# Altium schematic sheet Sheet1.SchDoc
size A1; SheetNumber: 1; SheetTotal: 1
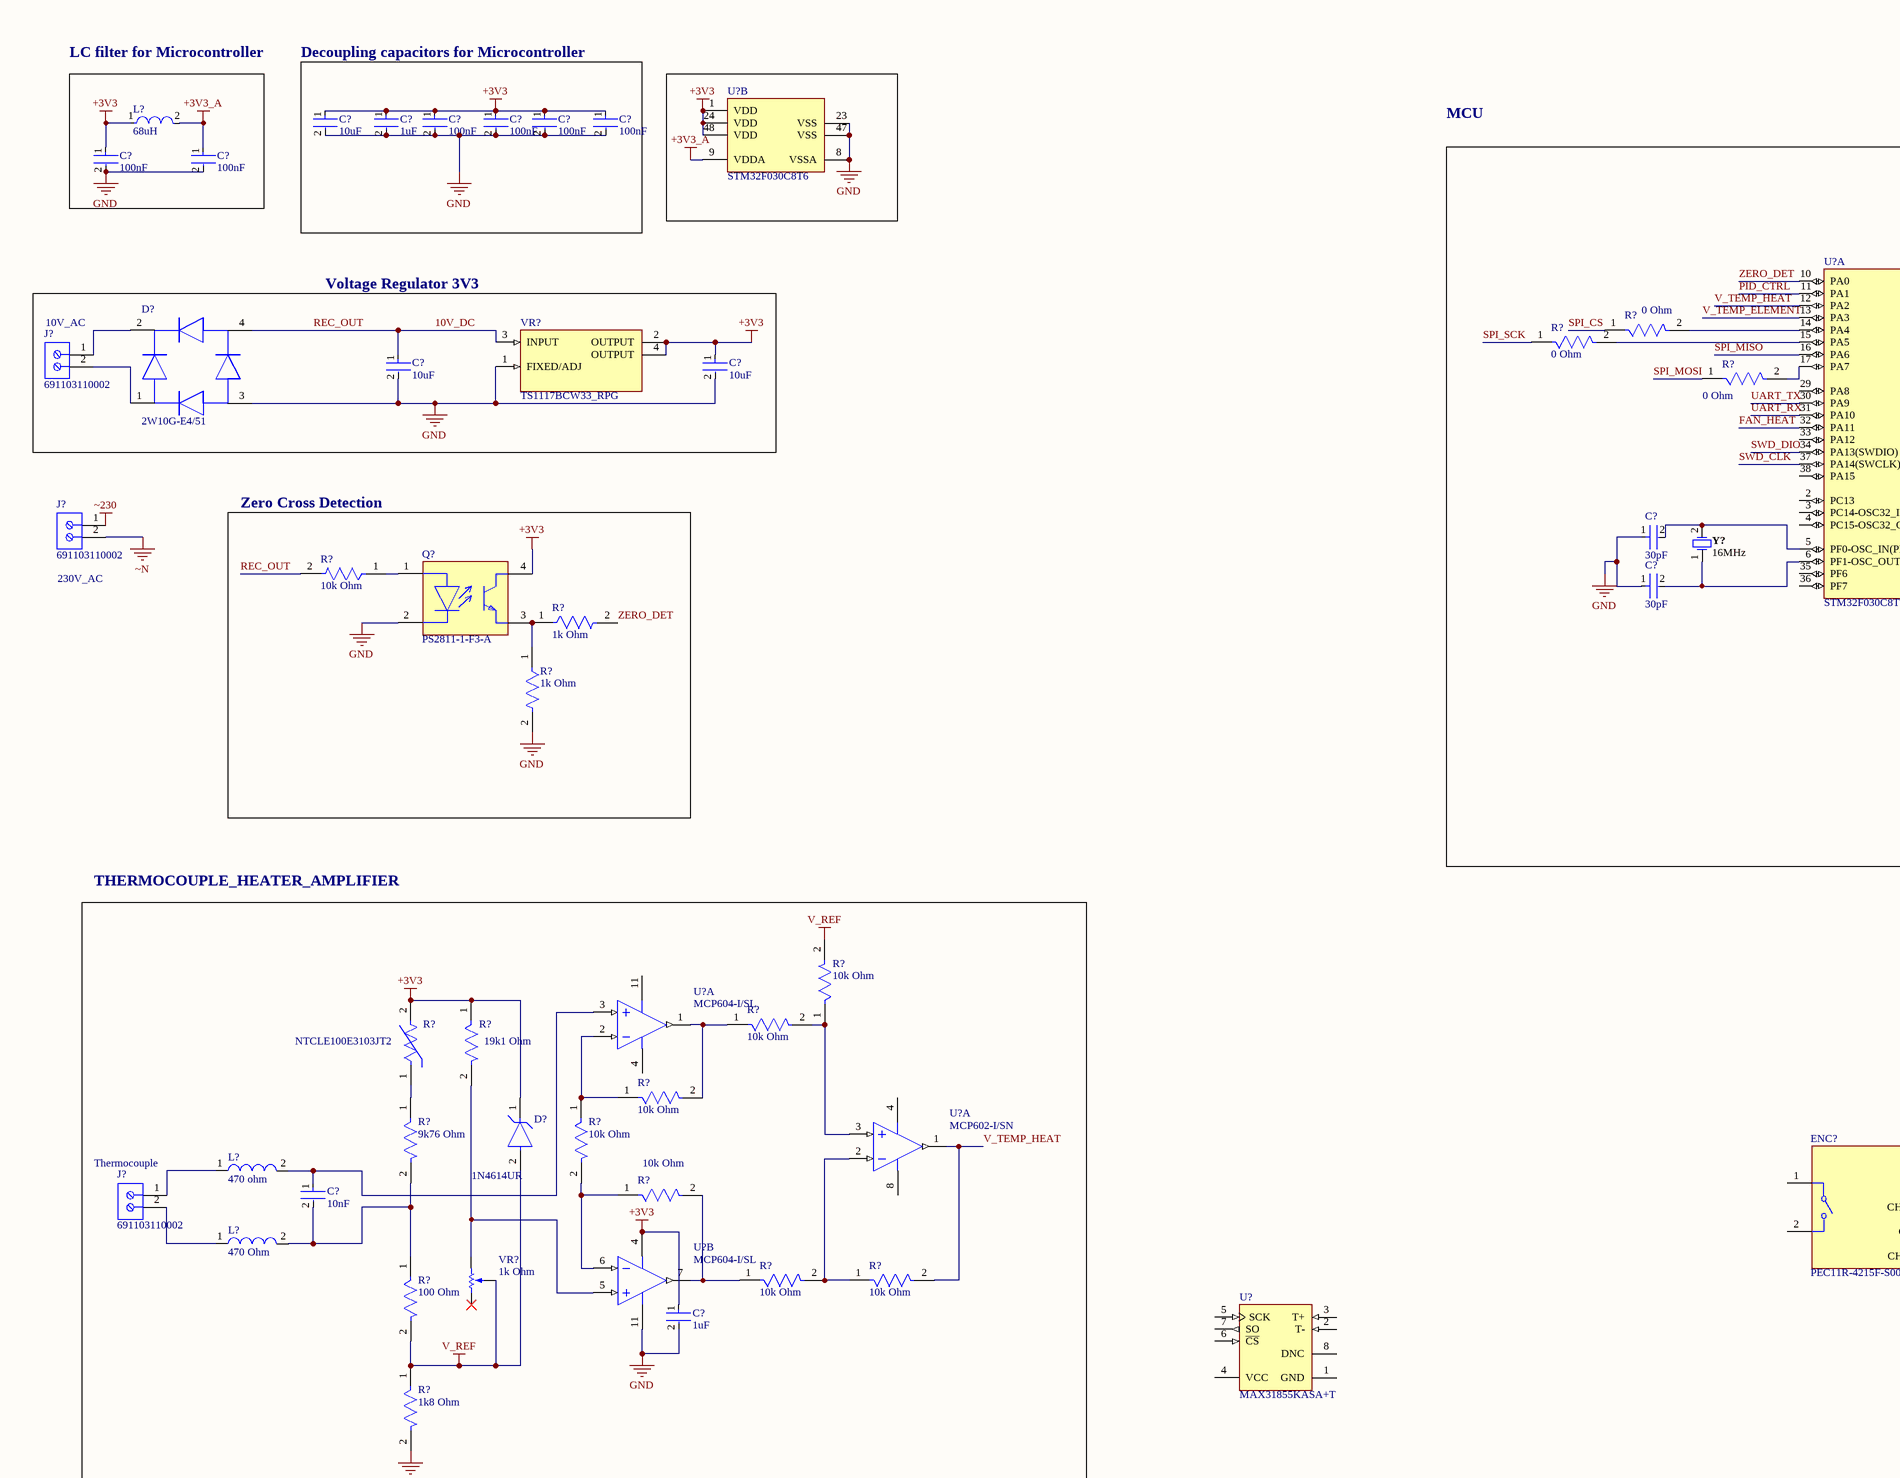
[diagram p0: Sheet1.SchDoc, top left]
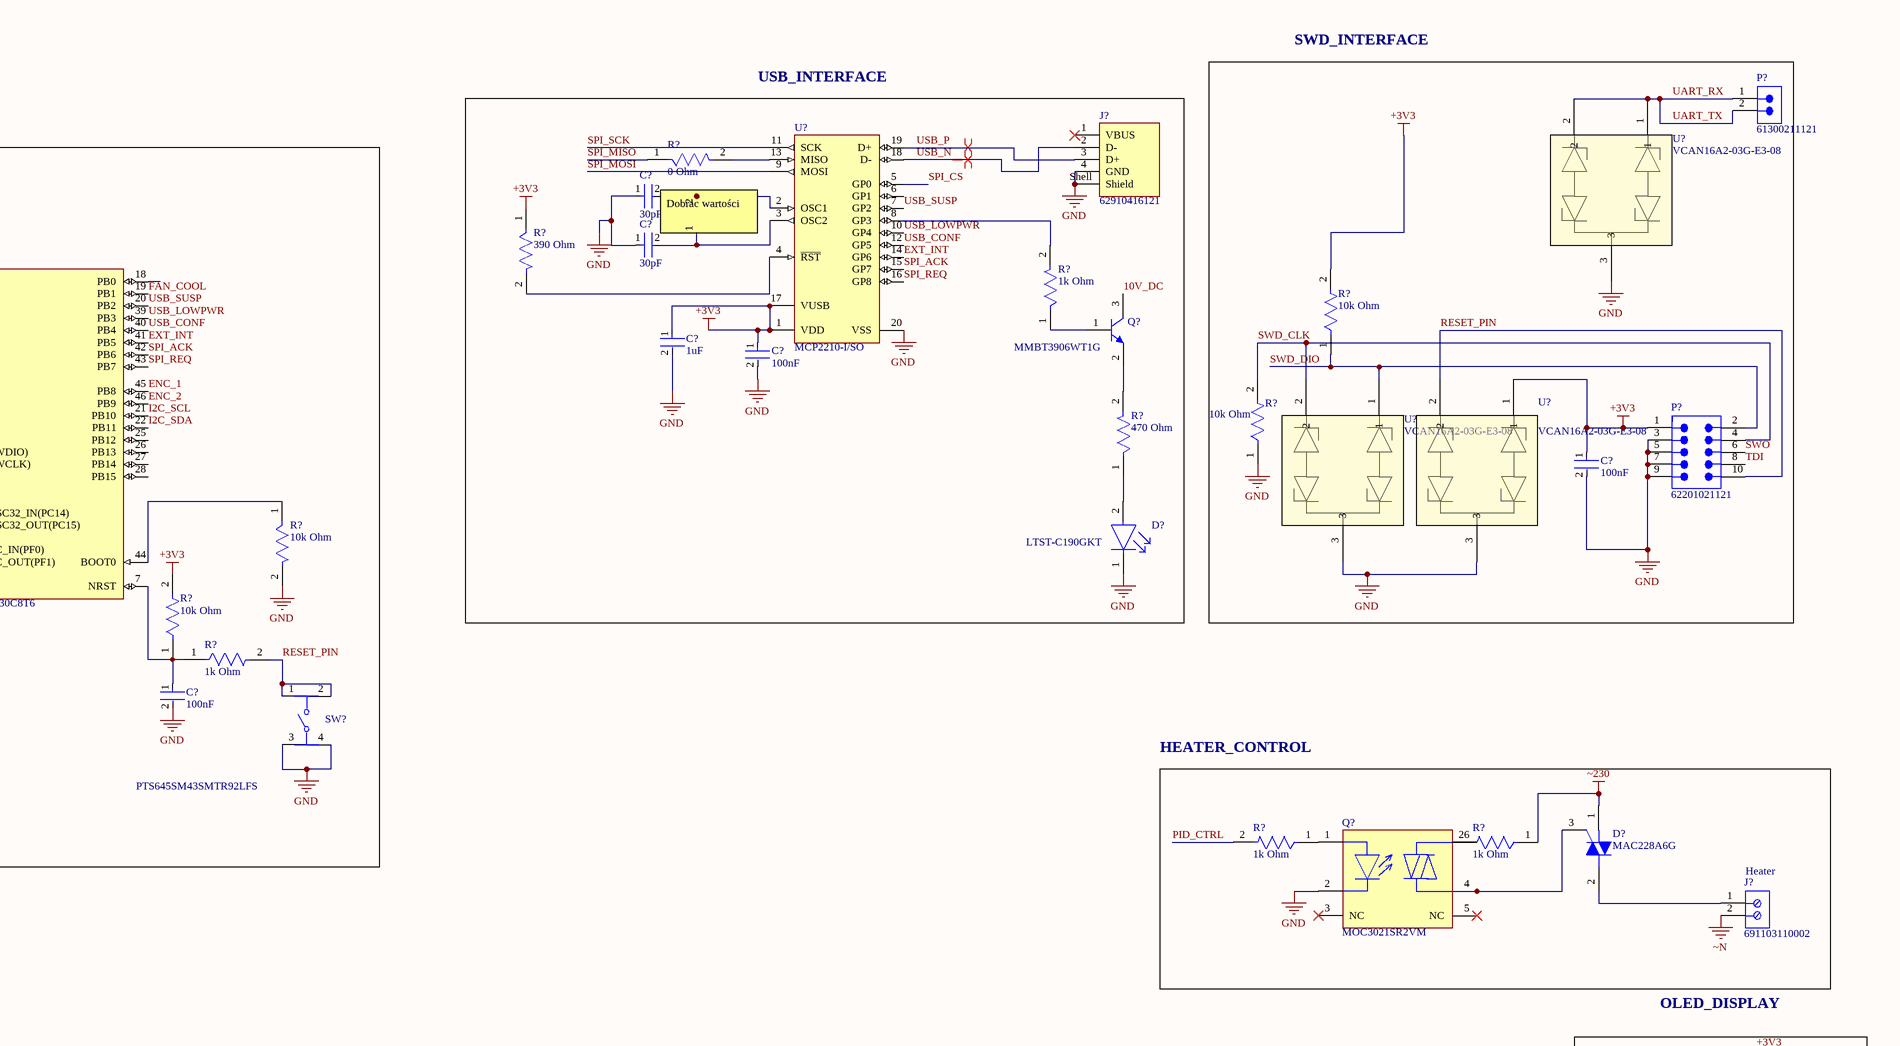
[diagram p1: Sheet1.SchDoc, top right]
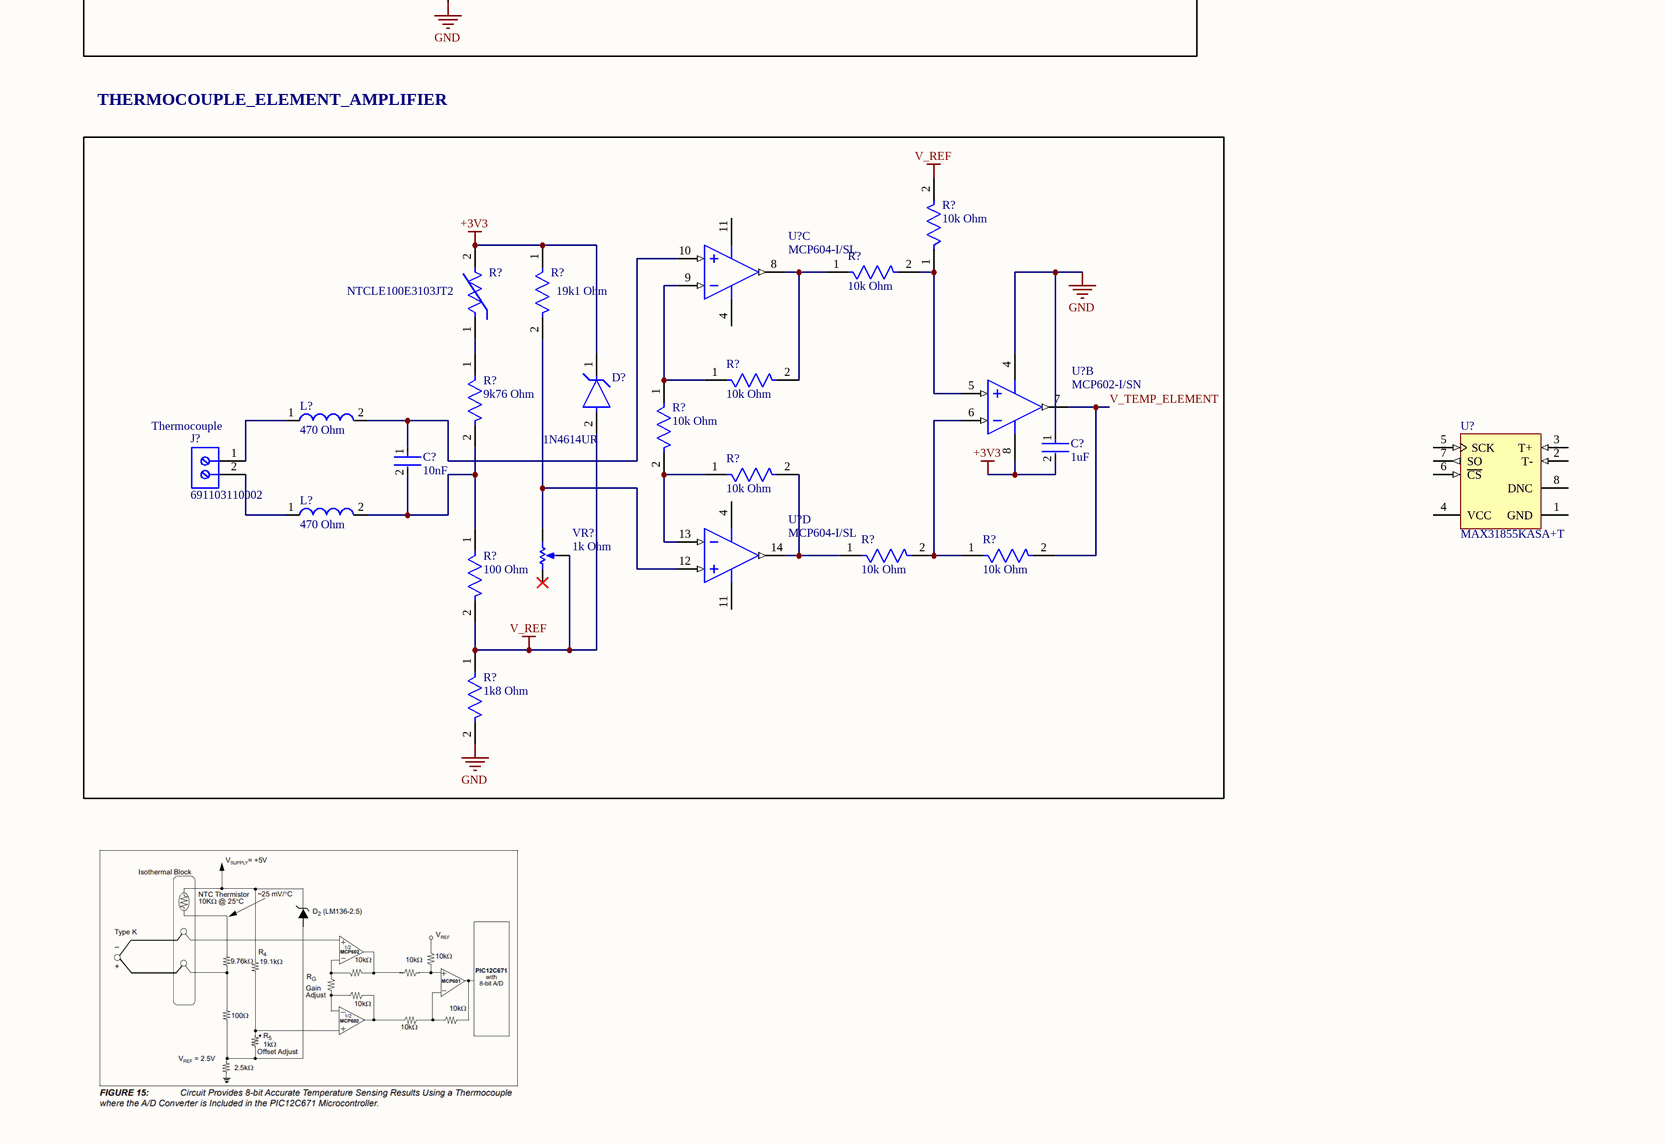
[diagram p2: Sheet1.SchDoc, bottom left]
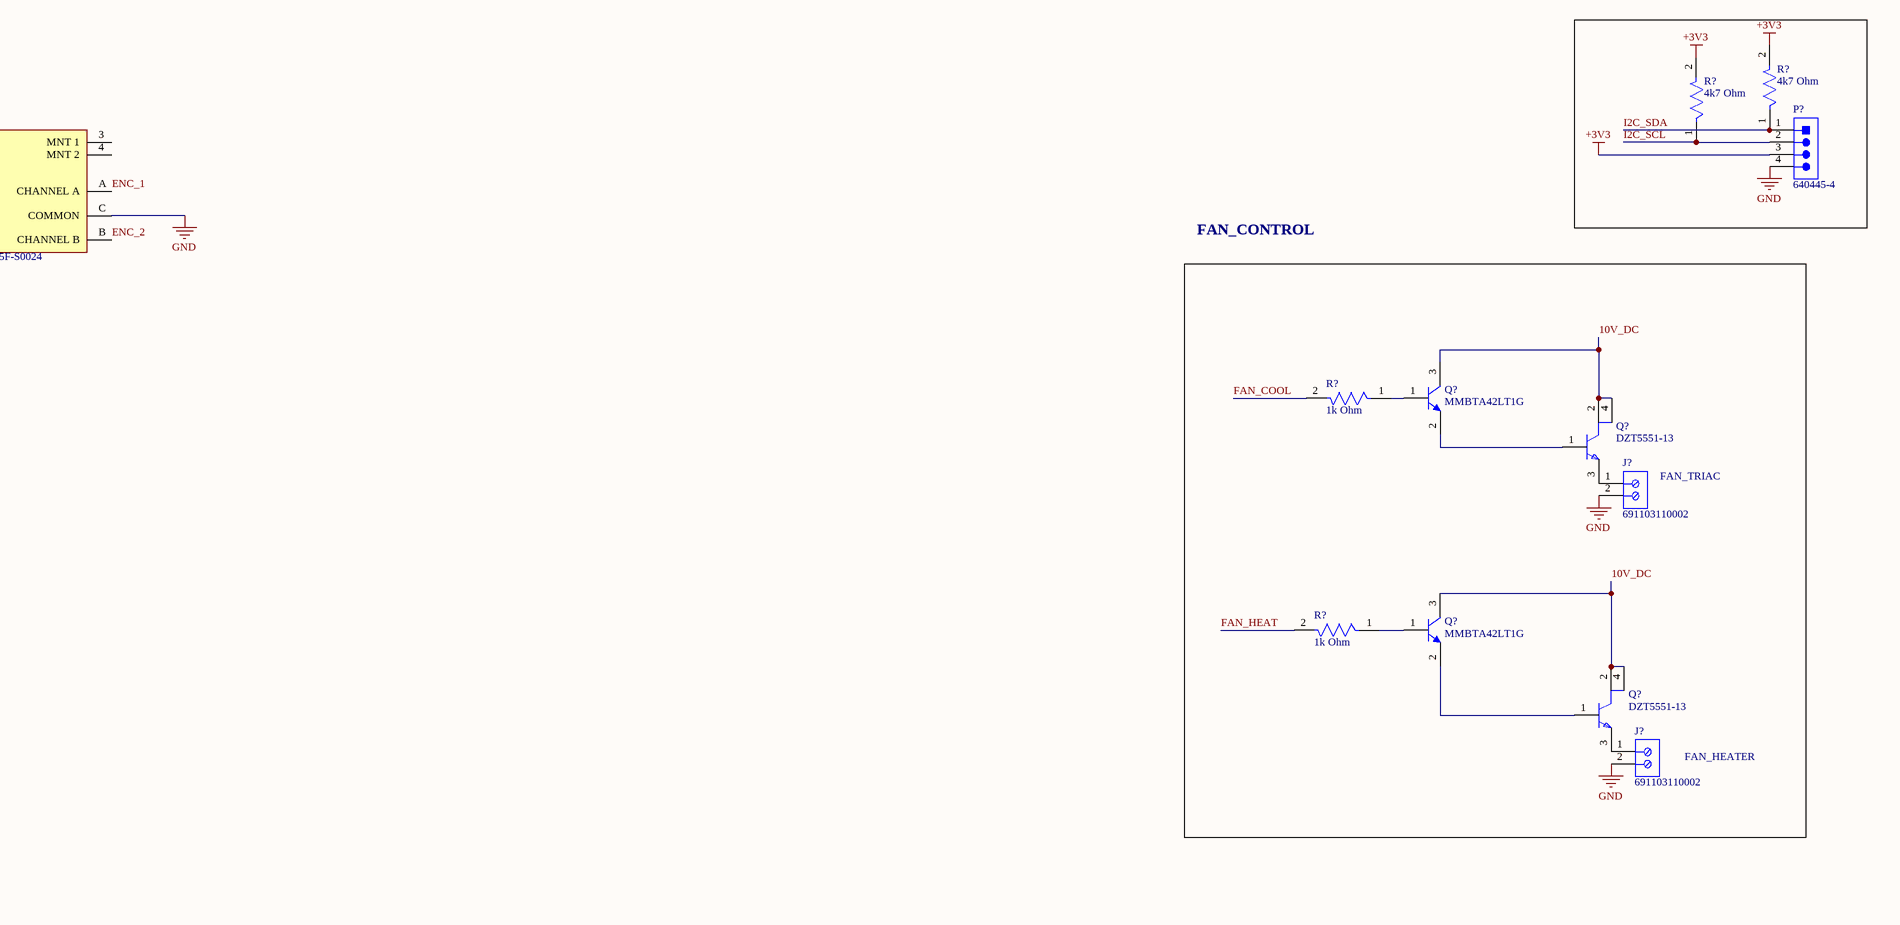
[diagram p3: Sheet1.SchDoc, bottom right]

## Parts
(Parts that share a designator on the sheet are numbered #1, #2 ... from top to bottom, then left to right.)
C?#1  10uF  [FP-CC0805-0_85-MFG]
C?#2  1uF  [FP-CC0805-0_85-MFG]
C?#3  100nF  [FP-CC0805-0_85-MFG]
C?#4  100nF  [FP-CC0805-0_85-MFG]
C?#5  100nF  [FP-CC0805-0_85-MFG]
C?#6  100nF  [FP-CC0805-0_85-MFG]
C?#7  100nF  [FP-CC0805-0_85-MFG]
C?#8  100nF  [FP-CC0805-0_85-MFG]
C?#9  30pF  [FP-CC0805-0_85-MFG]
C?#10  30pF  [FP-CC0805-0_85-MFG]
C?#11  1uF  [FP-CC0805-0_85-MFG]
C?#12  100nF  [FP-CC0805-0_85-MFG]
C?#13  10uF  [FP-CC0805-0_85-MFG]
C?#14  10uF  [FP-CC0805-0_85-MFG]
C?#15  100nF  [FP-CC0805-0_85-MFG]
C?#16  30pF  [FP-CC0805-0_85-MFG]
C?#17  30pF  [FP-CC0805-0_85-MFG]
C?#18  100nF  [FP-CC0805-0_85-MFG]
C?#19  10nF  [FP-CC0805-0_85-MFG]
C?#20  1uF  [FP-CC0805-0_85-MFG]
C?#21  1uF  [FP-CC0805-0_85-MFG]
C?#22  10nF  [FP-CC0805-0_85-MFG]
D?#1  2W10G-E4/51  [FP-WOG-MFG]
D?#2  LTST-C190GKT  [FP-LTST-C190GKT-MFG]
D?#3  MAC228A6G  [ONSC-TO-220-3-221A-09]
D?#4  1N4614UR  [FP-DO-213AA-MFG]
D?#5  1N4614UR  [FP-DO-213AA-MFG]
ENC?  PEC11R-4215F-S0024  [FP-PEC11R-4215F-S0024-MFG]
J?#1  62910416121  [62910416121]
J?#2  691103110002  [691103110002]
J?#3  691103110002  [691103110002]
J?#4  691103110002  [691103110002]
J?#5  691103110002  [691103110002]
J?#6  691103110002  [691103110002]
J?#7  691103110002  [691103110002]
J?#8  691103110002  [691103110002]
L?#1  68uH  [FP-CB2518-MFG]
L?#2  470 ohm  [SMD-0805]
L?#3  470 Ohm  [SMD-0805]
L?#4  470 Ohm  [SMD-0805]
L?#5  470 Ohm  [SMD-0805]
P?#1  61300211121  [61300211121]
P?#2  62201021121  [62201021121]
P?#3  640445-4  [TECO-640445-4_V]
Q?#1  MMBT3906WT1G  [ONSC-SC-70-3-419-04_V]
Q?#2  PS2811-1-F3-A  [SOP127P700X210_HS-5_SO4-Opto2_N]
Q?#3  MOC3021SR2VM  [FP-646BY-MFG]
Q?#4  MMBTA42LT1G  [ONSC-SOT-23-3-318-08_V]
Q?#5  DZT5551-13  [FP-SOT223-MFG]
Q?#6  MMBTA42LT1G  [ONSC-SOT-23-3-318-08_V]
Q?#7  DZT5551-13  [FP-SOT223-MFG]
R?#1  0 Ohm  [FP-RMCF0805-MFG]
R?#2  390 Ohm  [FP-RMCF0805-MFG]
R?#3  0 Ohm  [FP-RMCF0805-MFG]
R?#4  1k Ohm  [FP-RMCF0805-MFG]
R?#5  0 Ohm  [FP-RMCF0805-MFG]
R?#6  10k Ohm  [FP-RMCF0805-MFG]
R?#7  0 Ohm  [FP-RMCF0805-MFG]
R?#8  10k Ohm  [FP-RMCF0805-MFG]
R?#9  470 Ohm  [FP-RMCF0805-MFG]
R?#10  10k Ohm  [FP-RMCF0805-MFG]
R?#11  10k Ohm  [FP-RMCF0805-MFG]
R?#12  1k Ohm  [FP-RMCF0805-MFG]
R?#13  1k Ohm  [FP-RMCF0805-MFG]
R?#14  10k Ohm  [FP-RMCF0805-MFG]
R?#15  1k Ohm  [FP-RMCF0805-MFG]
R?#16  1k Ohm  [FP-RMCF0805-MFG]
R?#17  1k Ohm  [FP-RMCF0805-MFG]
R?#18  19k1 Ohm  [FP-RMCF0805-MFG]
R?#19  10k Ohm  [FP-RMCF0805-MFG]
R?#20  10k Ohm  [FP-RMCF0805-MFG]
R?#21  NTCLE100E3103JT2  [FP-NTCLE100E3103JT2-MFG]
R?#22  9k76 Ohm  [FP-RMCF0805-MFG]
R?#23  10k Ohm  [FP-RMCF0805-MFG]
R?#24  10k Ohm  [FP-RMCF0805-MFG]
R?#25  4k7 Ohm  [FP-RMCF0805-MFG]
R?#26  4k7 Ohm  [FP-RMCF0805-MFG]
R?#27  10k Ohm  [FP-RMCF0805-MFG]
R?#28  100 Ohm  [FP-RMCF0805-MFG]
R?#29  10k Ohm  [FP-RMCF0805-MFG]
R?#30  10k Ohm  [FP-RMCF0805-MFG]
R?#31  1k8 Ohm  [FP-RMCF0805-MFG]
R?#32  1k Ohm  [FP-RMCF0805-MFG]
R?#33  1k Ohm  [FP-RMCF0805-MFG]
R?#34  19k1 Ohm  [FP-RMCF0805-MFG]
R?#35  10k Ohm  [FP-RMCF0805-MFG]
R?#36  10k Ohm  [FP-RMCF0805-MFG]
R?#37  NTCLE100E3103JT2  [FP-NTCLE100E3103JT2-MFG]
R?#38  9k76 Ohm  [FP-RMCF0805-MFG]
R?#39  10k Ohm  [FP-RMCF0805-MFG]
R?#40  10k Ohm  [FP-RMCF0805-MFG]
R?#41  10k Ohm  [FP-RMCF0805-MFG]
R?#42  100 Ohm  [FP-RMCF0805-MFG]
R?#43  10k Ohm  [FP-RMCF0805-MFG]
R?#44  10k Ohm  [FP-RMCF0805-MFG]
R?#45  1k8 Ohm  [FP-RMCF0805-MFG]
SW?  PTS645SM43SMTR92LFS  [FP-PTS645SM43SMTR92LFS-MFG]
U?#1  STM32F030C8T6  [STM-LQFP48_M]  (part B of 2)
U?#2  VCAN16A2-03G-E3-08  [SOT_3G-E3-08_VIS]
U?#3  MCP2210-I/SO  [SOIC-SO20_N]
U?#4  STM32F030C8T6  [STM-LQFP48_M]  (part A of 2)
U?#5  VCAN16A2-03G-E3-08  [SOT_3G-E3-08_VIS]
U?#6  VCAN16A2-03G-E3-08  [SOT_3G-E3-08_VIS]
U?#7  MCP604-I/SL  [SOIC-SL14_M]  (part A of 4)
U?#8  MCP602-I/SN  [SOIC-SN8_M]  (part A of 2)
U?#9  MCP604-I/SL  [SOIC-SL14_M]  (part B of 4)
U?#10  MAX31855KASA+T  [MAXM-S8+4_N]
U?#11  MCP604-I/SL  [SOIC-SL14_M]  (part C of 4)
U?#12  MCP602-I/SN  [SOIC-SN8_M]  (part B of 2)
U?#13  MAX31855KASA+T  [MAXM-S8+4_N]
U?#14  MCP604-I/SL  [SOIC-SL14_M]  (part D of 4)
VR?#1  TS1117BCW33_RPG  [VREG_TS1117BCW50_RPG]
VR?#2  1k Ohm  [BOUR-3299W-3_V]
VR?#3  1k Ohm  [BOUR-3299W-3_V]
Y?#1  12MHz  [FOX-FOXSLF160-20]
Y?#2  16MHz  [FOX-FOXSLF160-20]

## Blocks framed on the sheet
LC filter for Microcontroller: C?#7 C?#8 L?#1
Decoupling capacitors for Microcontroller: C?#1-C?#6
SWD_INTERFACE: C?#15 P?#1 P?#2 R?#6 R?#8 U?#2 U?#5 U?#6
USB_INTERFACE: C?#9-C?#12 D?#2 J?#1 Q?#1 R?#1 R?#2 R?#4 R?#9 U?#3 Y?#1
Voltage Regulator 3V3: C?#13 C?#14 D?#1 J?#2 VR?#1
Zero Cross Detection: Q?#2 R?#11-R?#13
HEATER_CONTROL: D?#3 J?#4 Q?#3 R?#16 R?#17
THERMOCOUPLE_HEATER_AMPLIFIER: C?#19 C?#20 D?#4 J?#5 L?#2 L?#3 R?#18-R?#24 R?#27-R?#31 U?#7-U?#9 VR?#2
Thermocouple: C?#21 C?#22 D?#5 J?#8 L?#4 L?#5 R?#34-R?#45 U?#11 U?#12 U?#14 VR?#3

## Nets
+3V3: C?#1.1 C?#2.1 C?#3.1 C?#4.1 C?#5.1 C?#6.1 C?#7.1 C?#11.1 C?#12.1 C?#14.1 C?#15.1 C?#20.1 C?#21.2 D?#4.1(C) D?#5.1(C) L?#1.1 P?#2.1 P?#3.3 Q?#2.4(C) R?#2.1 R?#6.2 R?#14.2 R?#18.1 R?#21.2 R?#25.2 R?#26.2 R?#34.1 R?#37.2 U?#1.1(VDD) U?#1.24(VDD) U?#1.48(VDD) U?#3.1(VDD) U?#3.17(VUSB) U?#6.1 U?#9.4(VDD) U?#12.8(VDD) VR?#1.2(OUTPUT) VR?#1.4(OUTPUT)
+3V3_A: C?#8.1 L?#1.2 U?#1.9(VDDA)
GND: C?#1.2 C?#2.2 C?#3.2 C?#4.2 C?#5.2 C?#6.2 C?#7.2 C?#8.2 C?#9.1 C?#10.1 C?#11.2 C?#12.2 C?#13.2 C?#14.2 C?#15.2 C?#16.1 C?#17.1 C?#18.2 C?#20.2 C?#21.1 D?#1.3(-) D?#2.1(C) ENC?.C(COMMON) J?#1.4(GND) J?#1.Shell(Shield) J?#6.2 J?#7.2 P?#2.3 P?#2.5 P?#2.7 P?#2.9 P?#3.4 Q?#2.2(C) Q?#3.2(C) R?#8.1 R?#10.2 R?#13.2 R?#31.2 R?#45.2 SW?.3 SW?.4 U?#1.8(VSSA) U?#1.23(VSS) U?#1.47(VSS) U?#2.3 U?#3.20(VSS) U?#5.3 U?#6.3 U?#9.11(VSS) U?#12.4(VSS) VR?#1.1(FIXED/ADJ)
V_REF: D?#4.2(A) D?#5.2(A) R?#20.2 R?#28.2 R?#31.1 R?#36.2 R?#42.2 R?#45.1 VR?#2.2(WIPER) VR?#3.2(WIPER)
~230: D?#3.1(MT1) J?#3.1 R?#17.1
~N: J?#3.2 J?#4.2
10V_DC: C?#13.1 D?#1.4(2_~) Q?#1.3(C) Q?#4.3(C) Q?#5.2(C) Q?#6.3(C) Q?#7.2(C) Q?#7.4(C) R?#11.2 VR?#1.3(INPUT)  [also labelled REC_OUT]
ENC_1: ENC?.A(CHANNEL_A) U?#4.45(PB8)
ENC_2: ENC?.B(CHANNEL_B) U?#4.46(PB9)
EXT_INT: U?#3.14(GP6) U?#4.41(PB5)
FAN_COOL: R?#32.2 U?#4.19(PB1)
FAN_HEAT: R?#33.2 U?#4.32(PA11)
I2C_SCL: P?#3.2 R?#26.1 U?#4.21(PB10)
I2C_SDA: P?#3.1 R?#25.1 U?#4.22(PB11)
PID_CTRL: R?#16.2 U?#4.11(PA1)
RESET_PIN: P?#2.10 R?#15.2 SW?.1 SW?.2 U?#6.2
SPI_ACK: U?#3.15(GP7) U?#4.42(PB6)
SPI_CS: R?#3.1 U?#3.5(GP0)
SPI_MISO: R?#1.1 U?#4.16(PA6)
SPI_MOSI: R?#7.1 U?#3.9(MOSI)
SPI_REQ: U?#3.16(GP8) U?#4.43(PB7)
SPI_SCK: R?#5.1 U?#3.11(SCK)
SWD_CLK: P?#2.4 R?#8.2 U?#4.37(PA14(SWCLK)) U?#5.2
SWD_DIO: P?#2.2 R?#6.1 U?#4.34(PA13(SWDIO)) U?#5.1
SWO: P?#2.6
TDI: P?#2.8
UART_RX: P?#1.1 P?#1.2 U?#2.1 U?#2.2 U?#4.30(PA9) U?#4.31(PA10)  [also labelled UART_TX]
USB_CONF: U?#3.12(GP5) U?#4.40(PB4)
USB_LOWPWR: U?#3.10(GP4) U?#4.39(PB3)
USB_N: J?#1.2(D-) U?#3.18(D-)
USB_P: J?#1.3(D+) U?#3.19(D+)
USB_SUSP: U?#3.7(GP2) U?#4.20(PB2)
V_TEMP_ELEMENT: R?#44.2 U?#4.13(PA3) U?#12.7(VOUTB)
V_TEMP_HEAT: R?#30.2 U?#4.12(PA2) U?#8.1(VOUTA)
ZERO_DET: R?#12.2 U?#4.10(PA0)
NetC?#9_2: C?#9.2 U?#3.2(OSC1) Y?#1.2
NetC?#10_2: C?#10.2 U?#3.3(OSC2) Y?#1.1
NetC?#16_2: C?#16.2 U?#4.5(PF0-OSC_IN(PF0)) Y?#2.2
NetC?#17_2: C?#17.2 U?#4.6(PF1-OSC_OUT(PF1)) Y?#2.1
NetC?#18_1: C?#18.1 R?#14.1 R?#15.1 U?#4.7(NRST)
NetC?#19_1: C?#19.1 L?#2.2 U?#7.3(VINA+)
NetC?#19_2: C?#19.2 L?#3.2 R?#22.2 R?#28.1
NetC?#22_1: C?#22.1 L?#4.2 U?#11.10(VINC+)
NetC?#22_2: C?#22.2 L?#5.2 R?#38.2 R?#42.1
NetD?#1_1: D?#1.1(1_~) J?#2.2
NetD?#1_2: D?#1.2(+) J?#2.1
NetD?#2_2: D?#2.2(A) R?#9.1
NetD?#3_2: D?#3.2(MT2) J?#4.1
NetD?#3_3: D?#3.3(G) Q?#3.4(1_MAIN_TERM)
NetJ?#5_1: J?#5.1 L?#2.1
NetJ?#5_2: J?#5.2 L?#3.1
NetJ?#6_1: J?#6.1 Q?#5.3(E)
NetJ?#7_1: J?#7.1 Q?#7.3(E)
NetJ?#8_1: J?#8.1 L?#4.1
NetJ?#8_2: J?#8.2 L?#5.1
NetQ?#1_1: Q?#1.1(B) R?#4.1
NetQ?#1_2: Q?#1.2(E) R?#9.2
NetQ?#2_1: Q?#2.1(A) R?#11.1
NetQ?#2_3: Q?#2.3(E) R?#12.1 R?#13.1
NetQ?#3_1: Q?#3.1(A) R?#16.1
NetQ?#4_1: Q?#4.1(B) R?#32.1
NetQ?#4_2: Q?#4.2(E) Q?#5.1(B)
NetQ?#6_1: Q?#6.1(B) R?#33.1
NetQ?#6_2: Q?#6.2(E) Q?#7.1(B)
NetR?#1_2: R?#1.2 U?#3.13(MISO)
NetR?#2_2: R?#2.2 U?#3.4(~{RST})
NetR?#3_2: R?#3.2 U?#4.14(PA4)
NetR?#4_2: R?#4.2 U?#3.8(GP3)
NetR?#5_2: R?#5.2 U?#4.15(PA5)
NetR?#7_2: R?#7.2 U?#4.17(PA7)
NetR?#10_1: R?#10.1 U?#4.44(BOOT0)
NetR?#18_2: R?#18.2 U?#9.5(VINB+) VR?#2.1(CCW)
NetR?#19_1: R?#19.1 R?#24.2 U?#7.1(VOUTA)
NetR?#19_2: R?#19.2 R?#20.1 U?#8.3(VINA+)
NetR?#21_1: R?#21.1 R?#22.1
NetR?#23_1: R?#23.1 R?#24.1 U?#7.2(VINA-)
NetR?#23_2: R?#23.2 R?#27.1 U?#9.6(VINB-)
NetR?#27_2: R?#27.2 R?#29.1 U?#9.7(VOUTB)
NetR?#29_2: R?#29.2 R?#30.1 U?#8.2(VINA-)
NetR?#34_2: R?#34.2 U?#14.12(VIND+) VR?#3.1(CCW)
NetR?#35_1: R?#35.1 R?#40.2 U?#11.8(VOUTC)
NetR?#35_2: R?#35.2 R?#36.1 U?#12.5(VINB+)
NetR?#37_1: R?#37.1 R?#38.1
NetR?#39_1: R?#39.1 R?#40.1 U?#11.9(VINC-)
NetR?#39_2: R?#39.2 R?#41.1 U?#14.13(VIND-)
NetR?#41_2: R?#41.2 R?#43.1 U?#14.14(VOUTD)
NetR?#43_2: R?#43.2 R?#44.1 U?#12.6(VINB-)

Not connected (* = marked no-connect by the designer): ENC? 1 2 3(MNT_1) 4(MNT_2); J?#1 1(VBUS)*; Q?#3 3(NC)* 5(NC)* 6(2_MAIN_TERM); Q?#5 4(C); R?#17 2; U?#3 6(GP1); U?#4 2(PC13) 3(PC14-OSC32_IN(PC14)) 4(PC15-OSC32_OUT(PC15)) 18(PB0) 25(PB12) 26(PB13) 27(PB14) 28(PB15) 29(PA8) 33(PA12) 35(PF6) 36(PF7) 38(PA15); U?#7 4(VDD) 11(VSS); U?#8 4(VSS) 8(VDD); U?#10 1(GND) 2(T-) 3(T+) 4(VCC) 5(SCK) 6(~{CS}) 7(SO) 8(DNC); U?#11 4(VDD) 11(VSS); U?#13 1(GND) 2(T-) 3(T+) 4(VCC) 5(SCK) 6(~{CS}) 7(SO) 8(DNC); U?#14 4(VDD) 11(VSS); VR?#2 3(CW)*; VR?#3 3(CW)*

## Layout directives
differential pair: USB_N, USB_P

## Notes on the sheet
- MCU
- (near Y?#1) Dobrac wartości
- (near J?#2) 10V_AC
- (near J?#3) 230V_AC
- (near J?#4) Heater
- OLED_DISPLAY
- (near J?#5) Thermocouple
- FAN_CONTROL
- FAN_TRIAC
- THERMOCOUPLE_ELEMENT_AMPLIFIER
- FAN_HEATER

## Library data of the parts
C?#1 C?#2 C?#9-C?#11 C?#13 C?#14 C?#16 C?#17 C?#19-C?#22 = CMP-2100-03606-3: CAP CER 0.1UF 50V X7R 0805; Manufacturer Part Number: CC0805KRX7R9BB104; Manufacturer: Yageo; Tolerance: 0.1; Capacitance: 100 nF; Value: 100 nF; Material: Ceramic; Device Class L1: Passive Components; ComponentLink2Description: Datasheet; Package: CC0805-0.85; Digikey Description: CAP CER 0.1UF 50V X7R 0805; Device Class L3: Ceramic Capacitors; Temperature: -30°C to +85°C; Temperature Characteristic: X7R; Voltage Rating: 50 V; Height: 0.95mm; RoHS: TRUE; Ipc Land Pattern Name: CAPC200125X85; Device Class L2: Capacitors; Category: Cap; Temperature Range Low: -30°C; Temperature Range High: +85°C; Mouser Description: Multilayer Ceramic Capacitors MLCC - SMD/SMT 100nF 50V X7R 10%; Footprint Url: http://www.yageo.com/exep/pages/download/literatures/UPY-C_GEN_24.pdf; Automotive: No; Octopart: https://octopart.com/cc0805krx7r9bb104-yageo-192993; Lead Free: Yes; ComponentLink2URL: http://www.yageo.com/documents/recent/UPY-GPHC_Y5V_6.3V-to-50V_8.pdf
C?#3-C?#8 C?#12 C?#15 C?#18 = CMP-2100-03606-3: CAP CER 0.1UF 50V X7R 0805; Manufacturer Part Number: CC0805KRX7R9BB104; Manufacturer: Yageo; Tolerance: 0.1; Material: Ceramic; Device Class L1: Passive Components; ComponentLink2Description: Datasheet; Package: CC0805-0.85; Digikey Description: CAP CER 0.1UF 50V X7R 0805; Capacitance: 100 nF; Device Class L3: Ceramic Capacitors; Value: 100 nF; Temperature: -30°C to +85°C; Temperature Characteristic: X7R; Voltage Rating: 50 V; Height: 0.95mm; RoHS: TRUE; Ipc Land Pattern Name: CAPC200125X85; Device Class L2: Capacitors; Category: Cap; Temperature Range Low: -30°C; Temperature Range High: +85°C; Mouser Description: Multilayer Ceramic Capacitors MLCC - SMD/SMT 100nF 50V X7R 10%; Footprint Url: http://www.yageo.com/exep/pages/download/literatures/UPY-C_GEN_24.pdf; Automotive: No; Octopart: https://octopart.com/cc0805krx7r9bb104-yageo-192993; Lead Free: Yes; ComponentLink2URL: http://www.yageo.com/documents/recent/UPY-GPHC_Y5V_6.3V-to-50V_8.pdf
D?#1 = CMP-02540-000015-1: BRIDGE RECT 1PHASE 1KV 2A WOG; Manufacturer: Vishay; Capacitance: 20pF; Value: 20pF; Peak Reverse Current: 5uA; Max Repetitive Reverse Voltage: 1000V; Max Surge Forward Current: 60A; Max Junction Temp: +150°C; Lead Free: Yes; Temperature Range High: +150°C; Automotive: No; Mouser Description: Bridge Rectifiers 2.0 Amp 1000 Volt; Package: WOG; Category: Diode; Device Class L2: Diodes; RoHS: TRUE; Forward Current: 2A; Device Class L1: Discrete Semiconductors; Device Class L3: Rectifier Diodes; Temperature Range Low: -55°C; Temperature: -55°C to +150°C; Reverse Voltage: 1000V; ComponentLink2Description: Datasheet; ComponentLink2URL: http://www.vishay.com/docs/88528/2w005g.pdf; Octopart: https://octopart.com/2w10g-e4%2F51-vishay-42173035; Manufacturer Part Number: 2W10G-E4/51; Digikey Description: BRIDGE RECT 1PHASE 1KV 2A WOG; Height: 5.6mm
D?#2 = CMP-22017-000005-2: LED GREEN CLEAR CHIP SMD; Dominant Wavelength: 569nm; Reverse Voltage: 5V; Lens Color: Colorless; Viewing Angle: 130°; Voltage: 2V; Forward Current: 30mA; Power Dissipation: 100mW; Luminous Intensity: 6mcd; Number of LEDs: 1; Forward Voltage: 2.1V; Wavelength: 565nm; Test Current: 10mA; Min Operating Temperature: -55°C; Lens Style: Clear; Mount: Surface Mount; Width: 0.8mm; Packaging: Tape and Reel; Lens Transparency: Clear; Case Code (Metric): 1608; Depth: 0.8mm; Case Code (Imperial): 0603; Case/Package: 0603; Number of Pins: 2; Max Operating Temperature: 85°C; Lead Free: Lead Free; Number of Elements: 1; Length: 1.6mm; Height: 0.8mm; Package Quantity: 1; Power Rating: 100mW; Radiation Hardening: No; Illumination Color: Green; Color: Green
D?#3 = CMP-1070-00099-1: Sensitive Gate Triacs, Silicon Bidirectional Thyristor, 3-Pin TO-220, Pb-Free, Bulk Box; Manufacturer: On Semiconductor; ITSM Max (A): 80; IT(RMS) Max (A): 8; DatasheetVersion: Rev. 7; ComponentLink2Description: Datasheet; PackageDescription: 3-Pin Flange Mount, Vertical Straight Lead, Body 9.97 x 4.445 mm, Pitch 2.54 mm; Packing: Bulk Box; ComponentLink3Description: Package Specification; RoHS: Pb-Free; ComponentLink2URL: http://www.onsemi.com/pub_link/Collateral/MAC228A-D.PDF; PartNumber: MAC228A6G; ComponentLink3URL: http://www.onsemi.com/pub_link/Collateral/221A-09.PDF; ComponentLink1URL: http://www.onsemi.com/; PackageVersion: Rev. AG, 09/2011; PackageReference: TO-220-3-221A-09; ComponentLink1Description: Manufacturer URL; Mounting Technology: Through Hole
D?#4 D?#5 = CMP-00252-99173180-1: 1N4614UR Zener Diode, 1.8V V(Z), 5%, 0.5W, Silicon, Unidirectional, DO-213AA; Reverse Voltage: 1V; Impedance: 1.2kΩ; Max Reverse Leakage Current: 3.5µA; Max Power Dissipation: 500mW; Element Configuration: Single; Mount: Surface Mount; Height: 1.7mm; Number of Pins: 2; NexarPartId: 99173180; Radiation Hardening: Yes; Zener Voltage: 1.8V; Packaging: Bulk; Max Operating Temperature: 175°C; Min Operating Temperature: -65°C; RoHS: Non-Compliant; Contact Plating: Lead, Tin; Lifecycle Status: Production; Tolerance: 5%
ENC? = CMP-1747-00012-2: ROTARY ENCODER MECHANICAL 24PPR; Hole Diameter: 1.8mm; Output Type: Quadrature; Pulses per Revolution: 24; Number of Channels: 2; Built in Switch: Yes; Min Operating Temperature: -30°C; Series: PEC11R; Type: Mechanical; Package Quantity: 150; Length: 21.5mm; Max Operating Temperature: 70°C; Encoder Type: Mechanical; Height: 13.4mm; Detent: Yes; Packaging: Bulk; Orientation: Vertical; Width: 12.5mm; Termination: PC Pins; Mount: Through Hole; REACH SVHC: No SVHC; Radiation Hardening: No; RoHS Compliant: Yes
J?#1 = CMP-1502-03244-2: NexarPartId: 19991172; Contact Resistance: 20mΩ; Connector Type: USB; Number of Contacts: 4; Gender: Receptacle; Current Rating: 1.5A; USB Standard: USB 2.0; Operating Supply Voltage: 30V; Insulation Resistance: 1GΩ; Orientation: Horizontal; RoHS: Compliant; Lead Free: Lead Free; Min Operating Temperature: -40°C; Length: 16mm; Number of Pins: 4; Features: Shielded; Contact Plating: Gold; Packaging: Tape and Reel; Max Operating Temperature: 105°C; Termination: SMD/SMT; Mount: Horizontal, Surface Mount; REACH SVHC: Unknown
J?#2-J?#8 = CMP-1502-03254-2: NexarPartId: 18818286; Pitch: 3.5052mm; Current Rating: 10A; Number of Positions Per Level: 2; Plating: Steel; Number of Levels: 1; Voltage: 125V; Wire/Cable Gauge: 26AWG; Stripping Length: -6mm; Wire Gauge (Min): 16AWG; Packaging: Box; Number of Rows: 1; Color: Blue; Height: 8.5mm; Current: 10A; Lead Pitch: 3.5mm; RoHS: Compliant; Housing Material: Nylon; Width: 8mm; Length: 7mm; Contact Plating: Tin; Number of Pins: 2; Mount: Through Hole; Min Operating Temperature: -40°C; Number of Contacts: 2; REACH SVHC: Unknown; Termination: Screw; Wire Gauge (Max): 26AWG; Max Operating Temperature: 105°C; Voltage Rating: 125V; Contact Material: Brass, Copper, Nickel, Tin, Zinc
L?#1 = CMP-14484-000100-1: SMD Inductors 68uH ±10% 0.31A 1.95Ω 1007; Test Frequency: 2.52MHz; Max DC Current: 310mA; Saturation Current: 70mA; DC Resistance (DCR): 1.95R; Core Material: Ferrite; Self Resonant Frequency: 9.5MHz; Shielding: Unshielded; Inductance: 68uH; Case Code (Imperial): 1007; RoHS Compliant: Yes; Mount: Surface Mount; Package Quantity: 2000; Case/Package: 1007; Packaging: Tape and Reel; Length: 0.098inch; Resistor Type: Wirewound; Height: 1.8mm; Termination: SMD/SMT; Current Rating: 310mA; Tolerance: 10%; Height - Seated (Max): 0.079inch; Min Operating Temperature: -40°C; Depth: 2mm; Inductance Tolerance: 10%; Max Operating Temperature: 105°C; Width: 0.071inch; Halogen Free: Halogen Free; Case Code (Metric): 2518; Series: CB; Radiation Hardening: No
L?#2-L?#5 = CMP-0220-00035-1: SMD EMI Suppression Ferrite Bead WE-CBF, Z = 470 Ohm; PackageReference: SMD-0805; PackageVersion: 2005; ComponentLink2URL: http://www.we-online.de/katalog/media/pdf/742792036.pdf; ComponentLink1Description: Manufacturer Link; ComponentLink2Description: Datasheet; Impedance: 470 Ohm; DatasheetVersion: Dec-2005; ComponentLink1URL: http://www.we-online.com; PackageDescription: Chip Inductor, 2-Leads, Body 2.0 x 1.2 mm
P?#1 = CMP-1712-00002-6: NexarPartId: 20081794; Number of Contacts: 2; Pitch: 2.54mm; Connector Type: Male Pin; Voltage Rating: 250V; Current Rating: 3A; Gender: Male; Contact Resistance: 20mΩ; Height: 8.94mm; Lead Free: Lead Free; Number of Pins: 2; Termination: Through Hole; RoHS: Compliant; Lead Pitch: 2.54mm; REACH SVHC: No SVHC; Housing Material: PBT; Contact Mating Length: 5.9944mm; Min Operating Temperature: -40°C; Orientation: Vertical; Contact Material: Copper; Contact Gender: Male; Max Operating Temperature: 125°C; Number of Rows: 1; Number of Positions: 2; Packaging: Bulk; Contact Plating: Gold; Mount: Through Hole; Color: Black; Operating Supply Voltage: 250V
P?#2 = CMP-1502-00948-3: NexarPartId: 32855586; Pitch: 1.27mm; Operating Supply Voltage: 100V; Connector Type: Male Pin; Contact Resistance: 20mΩ; Current Rating: 1A; Number of Contacts: 10; Gender: Male; Contact Mating Length: 3.81mm; Max Operating Temperature: 105°C; Mount: Through Hole; Number of Pins: 10; Row Spacing: 1.27mm; Lead Pitch: 1.27mm; REACH SVHC: Unknown; Min Operating Temperature: -40°C; Contact Material: Copper; Orientation: Vertical; Contact Plating: Gold; Number of Rows: 2; RoHS: Compliant; Packaging: Box; Voltage Rating: 100V; Color: Black; Height: 5.65mm; Termination: Solder; Number of Positions: 10
P?#3 = CMP-1684-00016-1: Male Header, Pitch 3.962 mm, 1 x 4 Postion, Height 13.716 mm, Tail Length 3.175 mm, -55 to 105 degC, RoHS; Manufacturer: TE Connectivity; Number of Contacts: 4; Contact Centerline Spacing: 0.156 / in.; Temperature, Operating: -55to+105 / °C; Mount Angle: Vertical; Primary Type: InterconnectSystem; Mounting Hole Size: 0.07 / "; Material, Contact: CopperAlloy; Special Features: IDC,Pinstrip; Agency Approvals: CSA,UL; Voltage, Rating: 600 / V; Pin Spacing: 0.156 / "; Standards: UL94V-0HousingFlammabilityRating,RoHSCompliant,ELVCompliant; Brand/Series: MTA-156Series; Current, Rating: 7 / A; Material, Housing: ThermoplasticPolyester; Angle: Straight; Color, Housing: White; Wire, AWG: 26-18; Package Description: Male Header, Pitch 3.962 mm, 1 x 4 Postion, Height 13.716 mm, Tail Length 3.175 mm; Color: White; Application: Forwire-to-board; Length, Terminal Post: 0.125 / in.; Datasheet Version: Rev. AD5; Manufacturer URL: http://www.te.com; Type: PCBPlug; Number of Positions: 4; Connector Type: Male; Package Reference: THD; Length, Overall: 0.624 / "; Mounting Type: PCBMount; Length, Pin: 0.125 / "; Number of Rows: 1; Flammability Rating: UL94V-0; Termination: Solder; Contact Plating: Tin; Datasheet URL: http://www.te.com/commerce/DocumentDelivery/DDEController?Action=showdoc&DocId=Customer+Drawing%7F640445%7FAD5%7Fpdf%7FEnglish%7FENG_CD_640445_AD5.pdf%7F640445-4; Diameter, Insulation: 0.095"(SingleWire),0.07"(MassTerminationWires)
Q?#1 = CMP-1048-00381-1: General Purpose Transistor, PNP Silicon, 3-Pin SC70, Pb-Free, Tape and Reel; Manufacturer: On Semiconductor; IC Continuous (A): -0.2; fT Min (MHz): 250; PackageDescription: 3-Pin Small Outline Transistor, Body 2 x 1.25 mm, Pitch 0.65 mm; PartNumber: MMBT3906WT1G; ComponentLink2Description: Datasheet; Packing: Tape and Reel; Mounting Technology: Surface Mount; ComponentLink3Description: Package Specification; DatasheetVersion: Rev. 8; ComponentLink2URL: http://www.onsemi.cn/pub_link/Collateral/MMBT3904WT1-D.PDF; Polarity: PNP; ComponentLink3URL: http://www.onsemi.cn/pub_link/Collateral/419-04.PDF; ComponentLink1Description: Manufacturer URL; PackageReference: SC-70-3-419-04; ComponentLink1URL: http://www.onsemi.com/; RoHS: TRUE; PackageVersion: Rev. N, 11/2008
Q?#2 = CMP-00572-23028373-2: Optocoupler DC-IN 1-CH Transistor DC-OUT 4-Pin SSOP Embossed T/R; Manufacturer Lifecycle Status: ACTIVE; Max Input Current: 1A; Collector Emitter Saturation Voltage: 300mV; Current Transfer Ratio: 400%; Number of Circuits: 1; Forward Voltage: 1.4V; Max Power Dissipation: 120mW; Rise Time: 4µs; Max Collector Current: 40mA; Output Voltage: 40V; Forward Current: 50mA; Input Current: 5mA; Isolation Voltage: 2.5kV; Reverse Breakdown Voltage: 6V; ComponentLink1Description: Manufacturer's Website; Packaging: Cut Tape; RoHS: Compliant; Case/Package: SSOP; HelpURL: https://octopart.com/cad-content/api/get-model-datasheet/15189/23028373; Lead Free: Lead Free; Min Operating Temperature: -55°C; Height: 2.1mm; Number of Elements: 1; China RoHS: Compliant; Mount: Surface Mount; Number of Channels: 1; Lifecycle Status: Production; ComponentLink2URL: https://octopart.com/cad-content/api/get-model-datasheet/15189/23028373; Number of Pins: 4; Radiation Hardening: No; Collector Emitter Voltage (VCEO): 40V; ComponentLink2Description: Datasheet URL; ComponentLink1URL: http://www.renesas.com; REACH SVHC: No SVHC; Max Operating Temperature: 100°C
Q?#3 = CMP-00278-84330366-1: MOC3021SR2VM Triac Driver Output Optocoupler, 6-Pin DIP 400V Random Phase; Manufacturer Lifecycle Status: ACTIVE; Isolation Voltage: 7.5kV; Power Dissipation: 330mW; Hold Current: 100µA; Number of Circuits: 1; Approvals: EN, IEC, UL; Input Current: 60mA; Nominal Input Voltage: 1.15V; Reverse Breakdown Voltage: 3V; Max Input Voltage: 1.5V; Max Operating Temperature: 85°C; Weight: 810mg; Mount: Surface Mount; REACH SVHC: No SVHC; Case/Package: SMD/SMT; NexarPartId: 84330366; RoHS: Compliant; Lead Free: Lead Free; Schedule B: 8541408000, 8541408000; Number of Elements: 1; Number of Channels: 1; Packaging: Digi-Reel®; Forward Voltage: 1.15V; Forward Current: 60mA; Number of Pins: 6; Radiation Hardening: No; Output Voltage: 400V; Max Power Dissipation: 330mW; Lifecycle Status: Production; Min Operating Temperature: -40°C
Q?#4 Q?#6 = CMP-1048-00662-1: High Voltage Transistor, NPN Silicon, 3-Pin SOT-23, Pb-Free, Tape and Reel; Manufacturer: On Semiconductor; fT Min (MHz): 50; IC Continuous (A): 0.5; ComponentLink1URL: http://www.onsemi.com/; ComponentLink3URL: http://www.onsemi.cn/pub_link/Collateral/318-08.PDF; RoHS: TRUE; ComponentLink2Description: Datasheet; PartNumber: MMBTA42LT1G; Polarity: NPN; DatasheetVersion: Rev. 12; PackageReference: SOT-23-3-318-08; PackageDescription: 3-Pin Small Outline Transistor, Body 2.92 x 1.3 mm, Pitch 0.95 mm; ComponentLink3Description: Package Specification; ComponentLink1Description: Manufacturer URL; Packing: Tape and Reel; PackageVersion: Rev. AP, 11/2009; Mounting Technology: Surface Mount; ComponentLink2URL: http://www.onsemi.cn/pub_link/Collateral/MMBTA42LT1-D.PDF
Q?#5 Q?#7 = CMP-12798-000002-1: TRANS NPN 160V 0.6A SOT-223; Manufacturer: Diodes; Hfe Ss Min: 50; Rthja Max: 62.5°C/W; Emitter Base Voltage: 6V; Automotive Grade: Grade 0; Hfe Testic: 10mA; Hfe Ss Testic: 10A; Max Junction Temp: +150°C; Hfe Max: 250; Fall Time Tf: 140ns; Collector Base Voltage: 180V; Unity Gain Freq: 130MHz; Number Of Npn: 1; Standoff Height: 0.01mm; Delay Time Td: 95ns; Collector Emitter Breakdown Voltage: 200V; Hfe Ss Max: 260; Max Collector Current: 600mA; Hfe Testvce: 5V; Hfe Ss Testvce: 10V; Collector Emitter Saturation Voltage: 115mV; Hfe Min: 80; Rise Time Tr: 64ns; Power Dissipation: 2W; Footprint Url: https://www.diodes.com/assets/Package-Files/SOT223.pdf; ComponentLink2URL: https://www.diodes.com/assets/Datasheets/ds31219.pdf; Device Class L2: Transistors; Lead Free: Yes; Storage Time Ts: 1256ns; Temperature Range Low: -55°C; Mouser Description: Bipolar Transistors - BJT 1000mW 160Vceo; RoHS: TRUE; Collector Emitter Voltage: 160V; ComponentLink2Description: Datasheet; Device Class L3: BJTs; Automotive: Yes; Temperature: -55°C to +150°C; Package: SOT223; Device Class L1: Discrete Semiconductors; Temperature Range High: +150°C; Category: Trans; Digikey Description: TRANS NPN 160V 0.6A SOT-223; Height: 1.8mm; Octopart: https://octopart.com/dzt5551-13-diodes+inc.-12426785; Number Of Elements: 1; Manufacturer Part Number: DZT5551-13
R?#1-R?#20 R?#22-R?#36 R?#38-R?#45 = CMP-26527-000017-1: RES 0 OHM JUMPER 1/8W 0805; Power Rating: 125mW; Resistance: 0mR; Depth: 1.25mm; Length: 2mm; Military Standard: Not; Width: 0.049inch; Case Code (Imperial): 0805; Number of Terminations: 2; Mount: Surface Mount; Contact Plating: Tin; Height: 0.026inch; Case/Package: 0805; Min Operating Temperature: -55°C; Composition: Thick Film; Max Operating Temperature: 155°C; Packaging: Tape and Reel; Features: Automotive AEC-Q200; Max Power Dissipation: 125mW; Radiation Hardening: No; Lead Free: Lead Free; Case Code (Metric): 2012
R?#21 R?#37 = CMP-00030-44472533-1: NTCLE100E3103JT2 Thermistor NTC 10K Ohm 5% 2-Pin Radial 3977K -4.5 to -4 T/R; Lead Diameter: 600µm; Power Rating: 500mW; Accuracy: 0.75%; Resistance: 10kΩ; NexarPartId: 44472533; Number of Pins: 2; RoHS: Compliant; REACH SVHC: Unknown; Schedule B: 8533400080, 8533400080; Mount: Through Hole; Termination: Radial; Tolerance: 5%; Min Operating Temperature: -40°C; Lead Pitch: 2.54mm; Length: 3.3mm; Contact Plating: Tin; Case/Package: Radial; Packaging: Cut Tape (CT); Max Power Dissipation: 500mW; Max Operating Temperature: 125°C; Depth: 3mm; Radiation Hardening: No
SW? = CMP-2000-05160-2: SWITCH TACTILE SPST-NO 0.05A 12V; Contact Resistance: 100mR; Throw Configuration: SPST; Illumination Type: Non-Illuminated; Mechanical Life: 100000Cycles; Current Rating: 50mA; Switch Function: Off-Mom; Actuator Length: 0.85mm; Actuator Material: Nylon; Actuator Type: Standard; Operating Force: 160gf; Min Operating Temperature: -20°C; REACH SVHC: No SVHC; Termination: Gull Wing; Case/Package: SMD/SMT; Packaging: Tape and Reel; Mount: Surface Mount; Voltage Rating (DC): 12V; Orientation: Straight; Lead Free: Lead Free; Contact Material: Silver; Color: Black; Max Current Rating: 50mA; Contact Plating: Silver; Depth: 9mm; Package Quantity: 1; Max Voltage Rating (DC): 12V; Length: 6mm; Max Operating Temperature: 60°C
U?#1 U?#4 = CMP-0304-00024-2: ARM Cortex-M0 32-bit MCU, 64 KB Flash, 8 KB Internal RAM, 39 I/Os, 48-pin LQFP, -40 to 85 degC, Tray; FLASH Size (Prog) (kB): 64; I/Os (High Current): 39; Operating Frequency(F) (Processor speed) (MHz): 48; Supply Voltage(Vcc) min (V): 2.4; Internal RAM Size (kB): 8; Packing: Tray; ComponentLink2URL: http://www.st.com/st-web-ui/static/active/en/resource/technical/document/datasheet/DM00088500.pdf; PackageVersion: Rev. 6, 06/2013; ComponentLink2Description: Datasheet; PartNumber: STM32F030C8T6; PackageDescription: 48-Pin Low Profile Quad Flat Package, 7 x 7 mm Body, 0.5 mm Pitch; Mounting Technology: Surface Mount; ComponentLink1URL: http://www.st.com/web/en/home.html; PackageReference: LQFP48; ComponentLink3URL: http://www.st.com/st-web-ui/static/active/en/resource/technical/document/datasheet/DM00058181.pdf; DatasheetVersion: Rev. 1; Core: ARM Cortex-M0; ComponentLink1Description: Manufacturer URL; ComponentLink3Description: Package Specification
U?#2 U?#5 U?#6 = VCAN16A2-03G-E3-08: No Description Available; Mfr_Name: Vishay; RefDes: RefDes; Type: Type
U?#3 = CMP-0186-00211-1: USB-to-SPI Protocol Converter with GPIO (Master Mode), 20-Pin SOIC, Industrial Temperature; ComponentLink2URL: http://ww1.microchip.com/downloads/en/DeviceDoc/22288A.pdf; Code_JEDEC: MS-013-AC; PackageDescription: 20-Lead Plastic Small Outline (SO) - Wide 7.50mm Body [SOIC]; ComponentLink1Description: Manufacturer URL; ComponentLink3Description: Package Specification; DatasheetVersion: revA, Dec-2011; PackageReference: SOIC-SO20; Code_IPC: SOIC127P1030-20; ComponentLink3URL: http://www.microchip.com/stellent/groups/techpub_sg/documents/packagingspec/en012702.pdf; ComponentLink1URL: http://www.microchip.com/; PackageVersion: revBB, Aug-2009; ComponentLink2Description: Datasheet
U?#7 U?#9 U?#11 U?#14 = CMP-0187-00360-3: None; Supply Current: 230uA; Operating Supply Voltage: 5.5V; Number of Amplifiers: 4; Input Bias Current: 60pA; Output Current: 22mA; Unity Gain Bandwidth Product: 2.8MHz; Min Supply Voltage: 2.7V; Common Mode Rejection Ratio: 75dB; Slew Rate: 2.3V/µs; Input Offset Voltage-Max: 2mV; Amplifier Type: GENERAL PURPOSE; Max Supply Voltage: 6V; Power Supply Rejection Ratio (PSRR): 80dB; Voltage Gain: 115dB; Height: 1.25mm; Mount: Surface Mount; REACH SVHC: No SVHC; Min Operating Temperature: -40°C; Number of Pins: 14; Max Operating Temperature: 85°C; Radiation Hardening: No; Lead Free: Lead Free; Bandwidth: 2.8MHz; Number of Elements: 4; Case/Package: SOIC; Nominal Supply Current: 230uA; Number of Circuits: 4; Slew Rate-Nom: 2.3V/µs; Length: 8.65mm; RoHS Compliant: Yes; Input Offset Voltage (Vos): 2mV; Width: 3.9mm; Gain Bandwidth Product: 2.8MHz; Package Quantity: 57; Technology: CMOS; Number of Channels: 4; Packaging: Rail/Tube
U?#8 U?#12 = CMP-0187-00026-3: None; Common Mode Rejection Ratio: 75dB; Input Offset Voltage (Vos): 2mV; Bandwidth: 2.8MHz; Number of Circuits: 2; Voltage Gain: 115dB; Min Supply Voltage: 2.7V; Output Current: 22mA; Supply Current: 230uA; Amplifier Type: GENERAL PURPOSE; Power Supply Rejection Ratio (PSRR): 80dB; Input Bias Current: 1pA; Max Supply Voltage: 6V; Input Offset Voltage-Max: 3mV; Voltage: 7V; Slew Rate: 2.3V/µs; Operating Supply Voltage: 5.5V; Mount: Surface Mount; Number of Pins: 8; Max Operating Temperature: 85°C; Gain Bandwidth Product: 2.8MHz; Case/Package: SOIC; Lead Free: Lead Free; Number of Elements: 2; Technology: CMOS; Length: 4.9mm; Height: 1.25mm; Packaging: Rail/Tube; Number of Channels: 2; Min Operating Temperature: -40°C; Number of Amplifiers: 2; RoHS Compliant: Yes; Radiation Hardening: No; REACH SVHC: No SVHC; Width: 3.9mm; Slew Rate-Nom: 2.3V/µs; Package Quantity: 100; Nominal Supply Current: 230uA; Unity Gain Bandwidth Product: 2.8MHz
U?#10 U?#13 = CMP-0253-00398-1: Cold Junction Compensated Thermocouple to Digital Converter, 14 Bits Temperature Resolution, -40 to 125 degC, 8-Pin SOIC (S8+4), Pb-Free, Tape ang Reel; Interface: SPI; Parasite Pwr.: No; Functions: Thermocouple-to-Digital Converter; ComponentLink3Description: Package Specification; DatasheetVersion: Rev. 2; Generic Part Number: MAX31855; PartNumber: MAX31855KASA+T; PackageReference: S8+4; ComponentLink3URL: http://pdfserv.maximintegrated.com/package_dwgs/21-0041.PDF; Code_JEDEC: MS-012; Packing: Tape ang Reel; PackageDescription: 8-Pin Small-Outline IC, Narrow, Body 3.9 x 4.9 mm, Pitch 1.27 mm; Mounting Technology: Surface Mount; ComponentLink1URL: http://www.maximintegrated.com/; PackageVersion: Rev. D, 10/2012; ComponentLink2URL: http://datasheets.maximintegrated.com/en/ds/MAX31855.pdf; ComponentLink1Description: Manufacturer URL; ComponentLink2Description: Datasheet
VR?#1 = TS1117BCW50_RPG: Package: None; Price: None; Value: *; MP: TS1117BCW50_RPG; Availability: Unavailable
VR?#2 VR?#3 = CMP-2000-05078-1: Square Trimming Potentiometer, 10 KOhm, 500 mW, -55 to 125 degC, 3-Pin THD, RoHS, Tube; Brand: Bourns; Power Rating: 500mW(1/2W); Unit Weight: 0.035000oz; Qualification: Commercial; Element Type: Cermet; Resistance: 10kOhms; Tolerance: 10%; Temperature Coefficient: 100PPM/C; Voltage Rating: 300V; Adjustment: TopCrossed; Product: Multiturn; Datasheet Version: Sep-04; Datasheet URL: https://datasheet.ciiva.com/19482/769696-19482212.pdf; RoHS: True; Tradename: Trimpot; Product Type: SquareTrimmingPotentiometer; Mounting: PanelMount; Packaging: Tube; Package Reference: 3299W; Operating Temperature Range: -55Cto+125C; Length: 10.03mm; Termination Style: Pin; Manufacturer: Bourns; Manufacturer URL: http://www.bourns.com/; Product Category: TrimmerResistors-ThroughHole; Width: 9.53mm; Taper: Linear; Package Description: 3-Pin Surface Mount Device, Body 9.53 x 6.1 mm, Pitch 2.54 mm; Type: Trimmers; Series: 3299
Y?#1 Y?#2 = CMP-1749-00003-1: Resistance Weld Thru-Hole Crystal, 16 MHz, -20 to 70 degC, 2-Pin THD, RoHS, Bulk; Voltage Rating: 250 V; Tolerance: 1%; Resistance: 221 kohm; Case\Package: Axial; Power Rating: 250 mW; RoHSCompliant: true; Package Quantity: 200; Packaging: Bulk; Min Operating Temperature: -55 degC; DatasheetVersion: Mar-15; ComponentLink1URL: http://www.foxonline.com/; Max Operating Temperature: 155 degC; PackageReference: FOXSLF160-20; Mount: Through Hole; PackageDescription: 2-Pin Through Hole Device, Body 11.35 x 4.65 mm; ComponentLink1Description: Manufacturer URL; ComponentLink2URL: http://www.foxonline.com/pdfs/hc49slf.pdf; ComponentLink2Description: Datasheet; Length: 0.248 inch